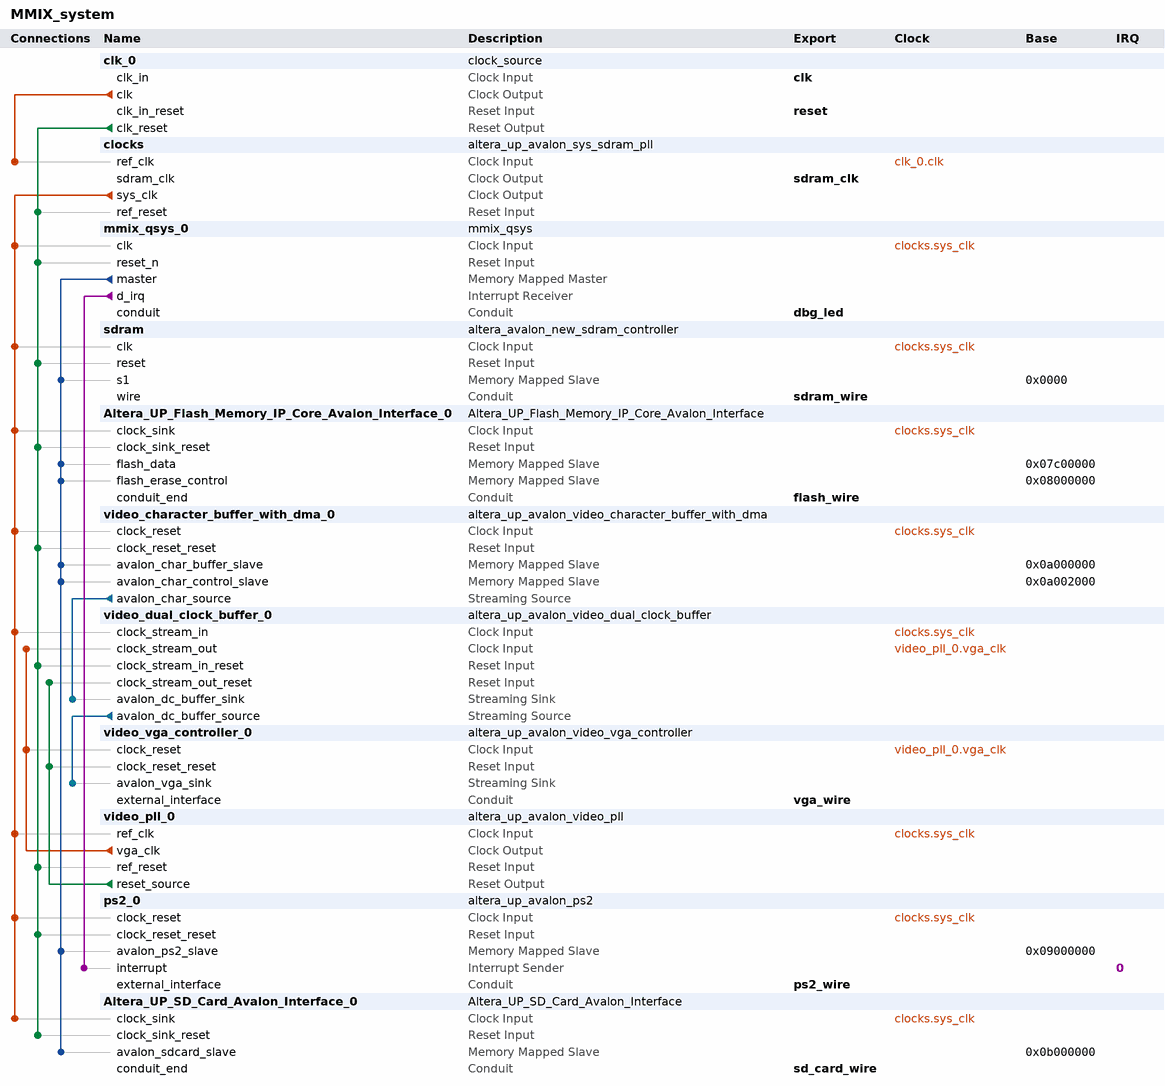
[diagram p0: system contents]
# Platform Designer (Qsys) system MMIX_system, Cyclone III EP3C16F484C6
# Parameters at their usual value, and those the tool derives, are not listed.
package require -exact qsys 13.1
create_system MMIX_system
set_project_property DEVICE_FAMILY {Cyclone III}
set_project_property DEVICE EP3C16F484C6

add_instance clk_0 clock_source 13.1
set_instance_parameter_value clk_0 clockFrequency 50000000

add_instance clocks altera_up_avalon_sys_sdram_pll 13.1
set_instance_parameter_value clocks gui_refclk 50.0
set_instance_parameter_value clocks gui_outclk 50.0
set_instance_parameter_value clocks CV_boards DE1-SoC

add_instance mmix_qsys_0 mmix_qsys 1.0

add_instance sdram altera_avalon_new_sdram_controller 13.1
set_instance_parameter_value sdram TAC 5.5
set_instance_parameter_value sdram TRCD 20.0
set_instance_parameter_value sdram TRP 20.0
set_instance_parameter_value sdram casLatency 3
set_instance_parameter_value sdram columnWidth 8
set_instance_parameter_value sdram dataWidth 16
set_instance_parameter_value sdram generateSimulationModel false
set_instance_parameter_value sdram model single_Micron_MT48LC4M32B2_7_chip
set_instance_parameter_value sdram numberOfBanks 4
set_instance_parameter_value sdram numberOfChipSelects 1
set_instance_parameter_value sdram powerUpDelay 100.0
set_instance_parameter_value sdram refreshPeriod 15.625
set_instance_parameter_value sdram rowWidth 12

add_instance Altera_UP_Flash_Memory_IP_Core_Avalon_Interface_0 Altera_UP_Flash_Memory_IP_Core_Avalon_Interface 13.1
set_instance_parameter_value Altera_UP_Flash_Memory_IP_Core_Avalon_Interface_0 FLASH_MEMORY_ADDRESS_WIDTH 22
set_instance_parameter_value Altera_UP_Flash_Memory_IP_Core_Avalon_Interface_0 FLASH_MEMORY_WAIT_COUNT 5

add_instance video_character_buffer_with_dma_0 altera_up_avalon_video_character_buffer_with_dma 13.1
set_instance_parameter_value video_character_buffer_with_dma_0 enable_transparency false

add_instance video_dual_clock_buffer_0 altera_up_avalon_video_dual_clock_buffer 13.1
set_instance_parameter_value video_dual_clock_buffer_0 color_bits 10

add_instance video_vga_controller_0 altera_up_avalon_video_vga_controller 13.1
set_instance_parameter_value video_vga_controller_0 board DE0
set_instance_parameter_value video_vga_controller_0 resolution {VGA 640x480}

add_instance video_pll_0 altera_up_avalon_video_pll 13.1
set_instance_parameter_value video_pll_0 gui_refclk 50.0
set_instance_parameter_value video_pll_0 camera {5MP Digital Camera}
set_instance_parameter_value video_pll_0 lcd {7" LCD on VEEK-MT and MTL Module}

add_instance ps2_0 altera_up_avalon_ps2 13.1

add_instance Altera_UP_SD_Card_Avalon_Interface_0 Altera_UP_SD_Card_Avalon_Interface 13.1

# connections
add_connection clk_0.clk clocks.ref_clk clock
add_connection clocks.sys_clk Altera_UP_Flash_Memory_IP_Core_Avalon_Interface_0.clock_sink clock
add_connection clocks.sys_clk Altera_UP_SD_Card_Avalon_Interface_0.clock_sink clock
add_connection clocks.sys_clk mmix_qsys_0.clk clock
add_connection clocks.sys_clk ps2_0.clock_reset clock
add_connection clocks.sys_clk sdram.clk clock
add_connection clocks.sys_clk video_character_buffer_with_dma_0.clock_reset clock
add_connection clocks.sys_clk video_dual_clock_buffer_0.clock_stream_in clock
add_connection clocks.sys_clk video_pll_0.ref_clk clock
add_connection video_pll_0.vga_clk video_dual_clock_buffer_0.clock_stream_out clock
add_connection video_pll_0.vga_clk video_vga_controller_0.clock_reset clock
add_connection clk_0.clk_reset Altera_UP_Flash_Memory_IP_Core_Avalon_Interface_0.clock_sink_reset reset
add_connection clk_0.clk_reset Altera_UP_SD_Card_Avalon_Interface_0.clock_sink_reset reset
add_connection clk_0.clk_reset clocks.ref_reset reset
add_connection clk_0.clk_reset mmix_qsys_0.reset_n reset
add_connection clk_0.clk_reset ps2_0.clock_reset_reset reset
add_connection clk_0.clk_reset sdram.reset reset
add_connection clk_0.clk_reset video_character_buffer_with_dma_0.clock_reset_reset reset
add_connection clk_0.clk_reset video_dual_clock_buffer_0.clock_stream_in_reset reset
add_connection clk_0.clk_reset video_pll_0.ref_reset reset
add_connection video_pll_0.reset_source video_dual_clock_buffer_0.clock_stream_out_reset reset
add_connection video_pll_0.reset_source video_vga_controller_0.clock_reset_reset reset
add_connection mmix_qsys_0.master Altera_UP_Flash_Memory_IP_Core_Avalon_Interface_0.flash_data avalon
set_connection_parameter_value mmix_qsys_0.master/Altera_UP_Flash_Memory_IP_Core_Avalon_Interface_0.flash_data baseAddress 0x07c00000
add_connection mmix_qsys_0.master Altera_UP_Flash_Memory_IP_Core_Avalon_Interface_0.flash_erase_control avalon
set_connection_parameter_value mmix_qsys_0.master/Altera_UP_Flash_Memory_IP_Core_Avalon_Interface_0.flash_erase_control baseAddress 0x08000000
add_connection mmix_qsys_0.master Altera_UP_SD_Card_Avalon_Interface_0.avalon_sdcard_slave avalon
set_connection_parameter_value mmix_qsys_0.master/Altera_UP_SD_Card_Avalon_Interface_0.avalon_sdcard_slave baseAddress 0x0b000000
add_connection mmix_qsys_0.master ps2_0.avalon_ps2_slave avalon
set_connection_parameter_value mmix_qsys_0.master/ps2_0.avalon_ps2_slave baseAddress 0x09000000
add_connection mmix_qsys_0.master sdram.s1 avalon
set_connection_parameter_value mmix_qsys_0.master/sdram.s1 baseAddress 0x0000
add_connection mmix_qsys_0.master video_character_buffer_with_dma_0.avalon_char_buffer_slave avalon
set_connection_parameter_value mmix_qsys_0.master/video_character_buffer_with_dma_0.avalon_char_buffer_slave baseAddress 0x0a000000
add_connection mmix_qsys_0.master video_character_buffer_with_dma_0.avalon_char_control_slave avalon
set_connection_parameter_value mmix_qsys_0.master/video_character_buffer_with_dma_0.avalon_char_control_slave baseAddress 0x0a002000
add_connection video_character_buffer_with_dma_0.avalon_char_source video_dual_clock_buffer_0.avalon_dc_buffer_sink avalon_streaming
add_connection video_dual_clock_buffer_0.avalon_dc_buffer_source video_vga_controller_0.avalon_vga_sink avalon_streaming
add_connection mmix_qsys_0.d_irq ps2_0.interrupt interrupt
set_connection_parameter_value mmix_qsys_0.d_irq/ps2_0.interrupt irqNumber 0

# exported interfaces
add_interface clk clock sink
set_interface_property clk EXPORT_OF clk_0.clk_in
add_interface reset reset sink
set_interface_property reset EXPORT_OF clk_0.clk_in_reset
add_interface sdram_wire conduit end
set_interface_property sdram_wire EXPORT_OF sdram.wire
add_interface sdram_clk clock source
set_interface_property sdram_clk EXPORT_OF clocks.sdram_clk
add_interface dbg_led conduit end
set_interface_property dbg_led EXPORT_OF mmix_qsys_0.conduit
add_interface flash_wire conduit end
set_interface_property flash_wire EXPORT_OF Altera_UP_Flash_Memory_IP_Core_Avalon_Interface_0.conduit_end
add_interface vga_wire conduit end
set_interface_property vga_wire EXPORT_OF video_vga_controller_0.external_interface
add_interface ps2_wire conduit end
set_interface_property ps2_wire EXPORT_OF ps2_0.external_interface
add_interface sd_card_wire conduit end
set_interface_property sd_card_wire EXPORT_OF Altera_UP_SD_Card_Avalon_Interface_0.conduit_end

set_interconnect_requirement {$system} qsys_mm.clockCrossingAdapter HANDSHAKE
set_interconnect_requirement {$system} qsys_mm.maxAdditionalLatency 1
set_interconnect_requirement {$system} qsys_mm.insertDefaultSlave false

save_system MMIX_system.qsys
